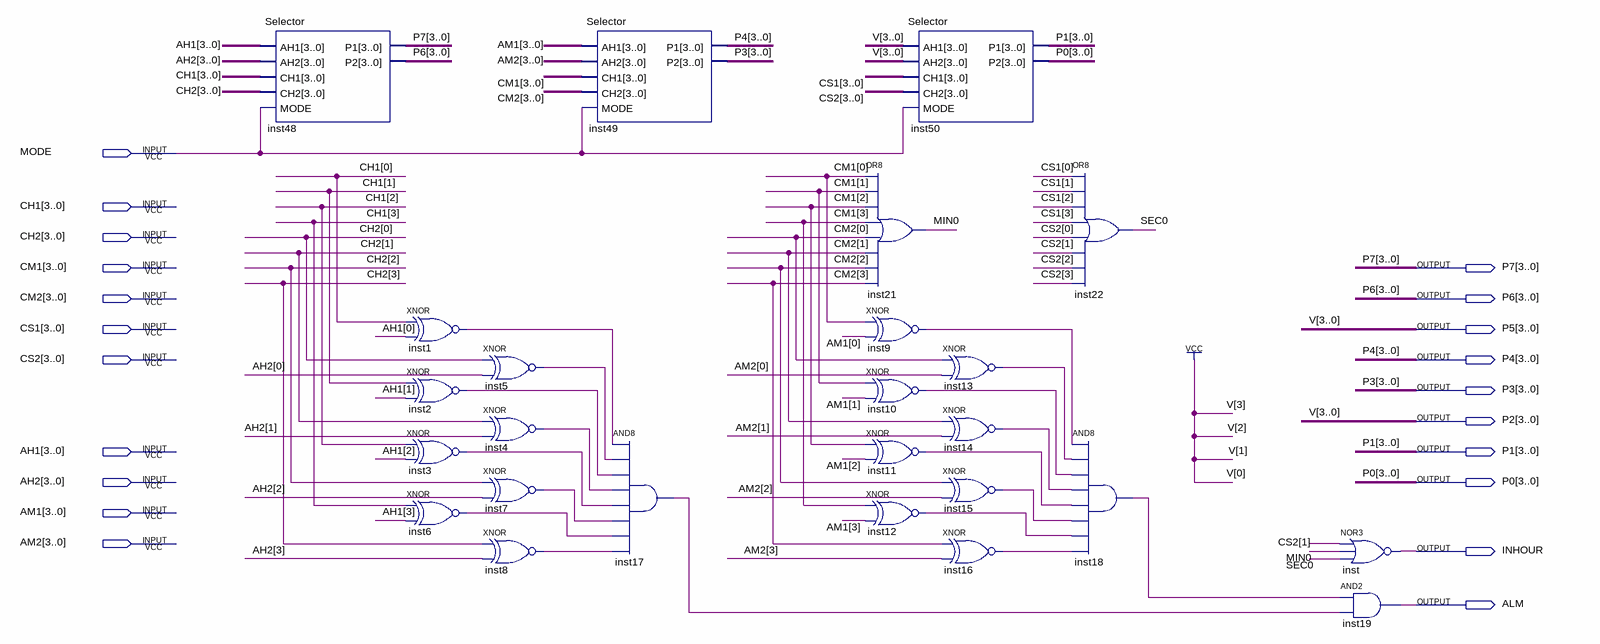
[diagram p0: schematic sheet]
// Quartus schematic Manager.bdf as structural Verilog: 25 symbols, 21 pins
module Manager (
  input  MODE,
  input  [3:0] CH1,
  input  [3:0] CH2,
  input  [3:0] CM1,
  input  [3:0] CM2,
  input  [3:0] CS1,
  input  [3:0] CS2,
  input  [3:0] AH1,
  input  [3:0] AH2,
  input  [3:0] AM1,
  input  [3:0] AM2,
  output [3:0] P7,
  output [3:0] P6,
  output [3:0] P5,
  output [3:0] P4,
  output [3:0] P3,
  output [3:0] P2,
  output [3:0] P1,
  output [3:0] P0,
  output INHOUR,
  output ALM
);

  wire inst1_out, inst2_out, inst3_out, inst4_out, inst5_out, inst6_out, inst7_out, inst8_out, inst9_out,
       inst10_out, inst11_out, inst12_out, inst13_out, inst14_out, inst15_out, inst16_out, inst17_out,
       inst18_out, MIN0, SEC0;

  Selector inst48 (.AH1(AH1), .AH2(AH2), .CH1(CH1), .CH2(CH2), .MODE(MODE), .P1(P7), .P2(P6));
  xnor inst1 (inst1_out, CH1[0], AH1[0]);
  xnor inst2 (inst2_out, CH1[1], AH1[1]);
  xnor inst3 (inst3_out, CH1[2], AH1[2]);
  xnor inst6 (inst6_out, CH1[3], AH1[3]);
  xnor inst5 (inst5_out, CH2[0], AH2[0]);
  xnor inst4 (inst4_out, CH2[1], AH2[1]);
  xnor inst7 (inst7_out, CH2[2], AH2[2]);
  xnor inst8 (inst8_out, CH2[3], AH2[3]);
  Selector inst49 (.AH1(AM1), .AH2(AM2), .CH1(CM1), .CH2(CM2), .MODE(MODE), .P1(P4), .P2(P3));
  and inst17 (inst17_out, inst1_out, inst5_out, inst2_out, inst4_out, inst3_out, inst7_out, inst6_out, inst8_out);
  or inst21 (MIN0, CM1[0], CM1[1], CM1[2], CM1[3], CM2[0], CM2[1], CM2[2], CM2[3]);
  xnor inst9 (inst9_out, CM1[0], AM1[0]);
  xnor inst10 (inst10_out, CM1[1], AM1[1]);
  xnor inst11 (inst11_out, CM1[2], AM1[2]);
  xnor inst12 (inst12_out, CM1[3], AM1[3]);
  Selector inst50 (.AH1(4'b1111), .AH2(4'b1111), .CH1(CS1), .CH2(CS2), .MODE(MODE), .P1(P1), .P2(P0));
  xnor inst13 (inst13_out, CM2[0], AM2[0]);
  xnor inst14 (inst14_out, CM2[1], AM2[1]);
  xnor inst15 (inst15_out, CM2[2], AM2[2]);
  xnor inst16 (inst16_out, CM2[3], AM2[3]);
  or inst22 (SEC0, CS1[0], CS1[1], CS1[2], CS1[3], CS2[0], CS2[1], CS2[2], CS2[3]);
  and inst18 (inst18_out, inst9_out, inst13_out, inst10_out, inst14_out, inst11_out, inst15_out, inst12_out, inst16_out);
  nor inst (INHOUR, CS2[1], MIN0, SEC0);
  and inst19 (ALM, inst18_out, inst17_out);

  assign P2 = 4'b1111;
  assign P5 = 4'b1111;
endmodule
